# Altium schematic sheet Block_Diagram.SchDoc: Block Diagram
size A4; Revision: 1.0; SheetNumber: 1; SheetTotal: 11; Class: B
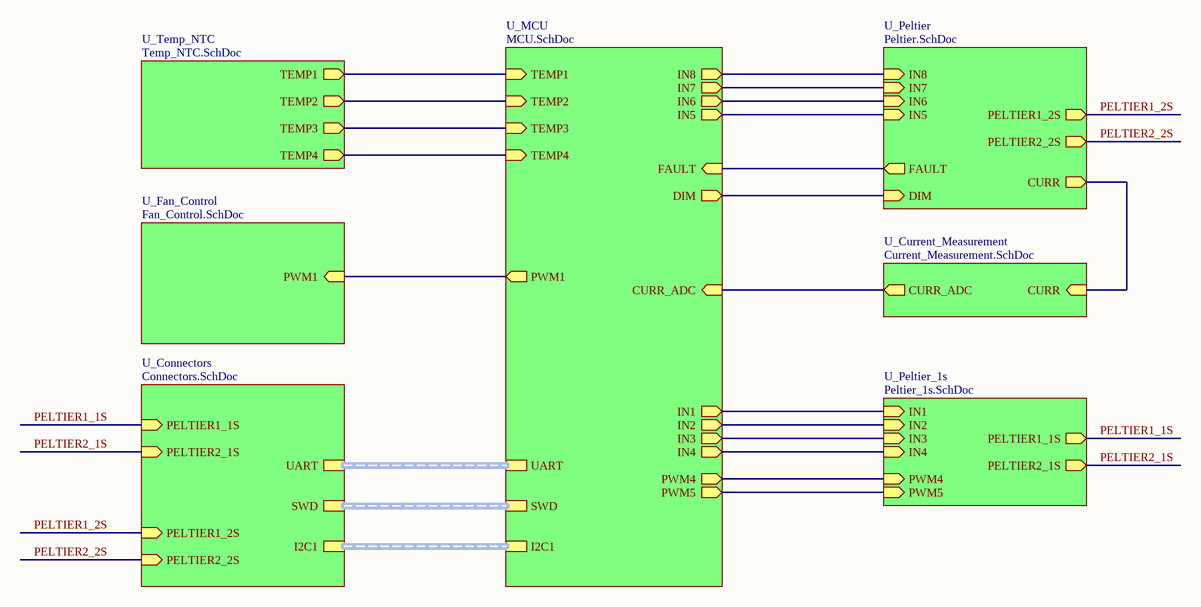
[diagram p0: Block_Diagram.SchDoc]

## Sub-sheets
U_Connectors = Connectors.SchDoc: SWD (harness SWD), UART (harness UART), PELTIER1_2S (in), PELTIER2_1S (in), PELTIER1_1S (in), PELTIER2_2S (in), I2C1 (harness I2C1)
U_Current_Measurement = Current_Measurement.SchDoc: CURR_ADC (out), CURR (in)
U_Fan_Control = Fan_Control.SchDoc: PWM1 (in)
U_MCU = MCU.SchDoc: FAULT (in), CURR_ADC (in), SWD (harness SWD), TEMP1 (in), TEMP2 (in), TEMP3 (in), TEMP4 (in), DIM (out), UART (harness UART), PWM1 (out), PWM4 (out), IN2 (out), IN4 (out), IN3 (out), PWM5 (out), IN1 (out), IN6 (out), IN5 (out), IN8 (out), IN7 (out), I2C1
U_Peltier = Peltier.SchDoc: DIM (in), FAULT (out), PELTIER1_2S (out), PELTIER2_2S (out), IN6 (in), IN5 (in), CURR (out), IN8 (in), IN7 (in)
U_Peltier_1s = Peltier_1s.SchDoc: PELTIER1_1S (out), PELTIER2_1S (out), PWM4 (in), PWM5 (in), IN1 (in), IN2 (in), IN3 (in), IN4 (in)
U_Temp_NTC = Temp_NTC.SchDoc: TEMP1 (out), TEMP3 (out), TEMP4 (out), TEMP2 (out)

## Nets
PELTIER1_1S: sheet U_Connectors/PELTIER1_1S, sheet U_Peltier_1s/PELTIER1_1S
PELTIER1_2S: sheet U_Peltier/PELTIER1_2S, sheet U_Connectors/PELTIER1_2S
PELTIER2_1S: sheet U_Connectors/PELTIER2_1S, sheet U_Peltier_1s/PELTIER2_1S
PELTIER2_2S: sheet U_Peltier/PELTIER2_2S, sheet U_Connectors/PELTIER2_2S
(unnamed): sheet U_Current_Measurement/CURR_ADC, sheet U_MCU/CURR_ADC
(unnamed): sheet U_Current_Measurement/CURR, sheet U_Peltier/CURR
(unnamed): sheet U_Peltier/DIM, sheet U_MCU/DIM
(unnamed): sheet U_Peltier/FAULT, sheet U_MCU/FAULT
(unnamed): sheet U_Peltier/IN6, sheet U_MCU/IN6
(unnamed): sheet U_Peltier/IN5, sheet U_MCU/IN5
(unnamed): sheet U_Peltier/IN8, sheet U_MCU/IN8
(unnamed): sheet U_Peltier/IN7, sheet U_MCU/IN7
(unnamed): sheet U_Temp_NTC/TEMP1, sheet U_MCU/TEMP1
(unnamed): sheet U_Temp_NTC/TEMP3, sheet U_MCU/TEMP3
(unnamed): sheet U_Temp_NTC/TEMP4, sheet U_MCU/TEMP4
(unnamed): sheet U_Temp_NTC/TEMP2, sheet U_MCU/TEMP2
(unnamed): sheet U_MCU/PWM1, sheet U_Fan_Control/PWM1
(unnamed): sheet U_MCU/PWM4, sheet U_Peltier_1s/PWM4
(unnamed): sheet U_MCU/IN2, sheet U_Peltier_1s/IN2
(unnamed): sheet U_MCU/IN4, sheet U_Peltier_1s/IN4
(unnamed): sheet U_MCU/IN3, sheet U_Peltier_1s/IN3
(unnamed): sheet U_MCU/PWM5, sheet U_Peltier_1s/PWM5
(unnamed): sheet U_MCU/IN1, sheet U_Peltier_1s/IN1

## Buses and harness runs
harness sheet U_Connectors/I2C1 = sheet U_MCU/I2C1
harness sheet U_Connectors/SWD = sheet U_MCU/SWD
harness sheet U_Connectors/UART = sheet U_MCU/UART

## Notes on the sheet
- Title:
- Date:
- Revision:
- Class:
- Sheet
- of